# Altium project F1956.PrjPcb
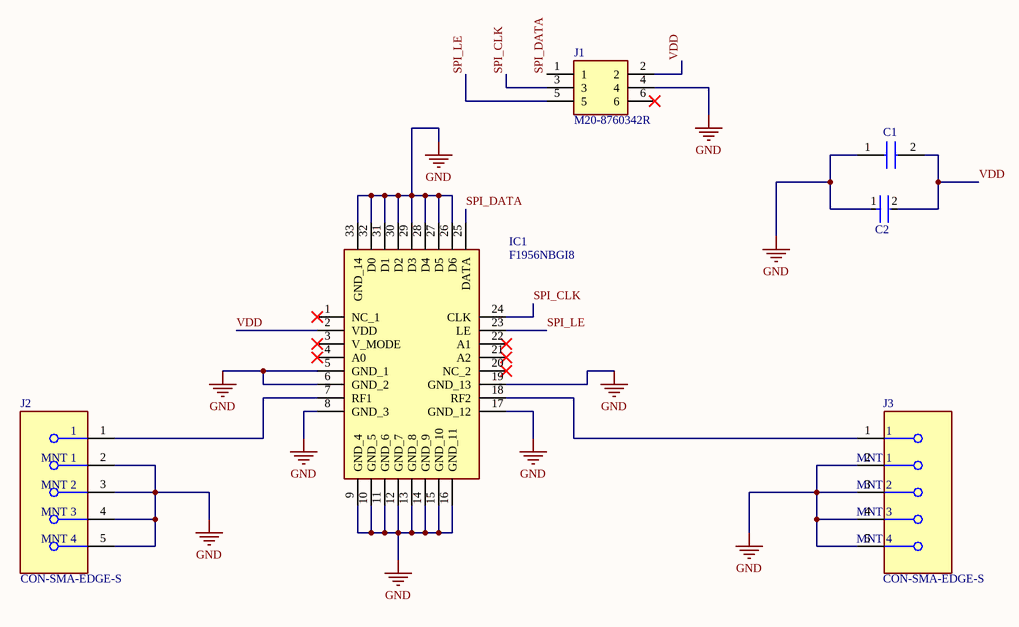
[diagram p0: F1956.SchDoc]
1 sheet, 6 parts. Net scope: global (net labels, ports and power ports of the same name join across sheets).
Board file: F1956.PcbDoc

## Sheet F1956.SchDoc
size A

### Parts
C1  GJ821BR71H105KA12K  [CAPC2012X135N]  (value not drawn)
C2  GRM21A5C2E102FWA1J  [FP-GRM21A-0_2-MFG]  (value not drawn)
IC1  F1956NBGI8  [QFN50P500X500X80-33N-D]
J1  M20-8760342R  [M208760342R]
J2  CON-SMA-EDGE-S  [FP-CON-SMA-EDGE-S-MFG]
J3  CON-SMA-EDGE-S  [FP-CON-SMA-EDGE-S-MFG]

### Nets
GND: C1.1 C2.1 IC1.5(GND_1) IC1.6(GND_2) IC1.8(GND_3) IC1.9(GND_4) IC1.10(GND_5) IC1.11(GND_6) IC1.12(GND_7) IC1.13(GND_8) IC1.14(GND_9) IC1.15(GND_10) IC1.16(GND_11) IC1.17(GND_12) IC1.19(GND_13) IC1.26(D6) IC1.27(D5) IC1.28(D4) IC1.29(D3) IC1.30(D2) IC1.31(D1) IC1.32(D0) IC1.33(GND_14) J1.4 J2.2(MNT_1) J2.3(MNT_2) J2.4(MNT_3) J2.5(MNT_4) J3.2(MNT_1) J3.3(MNT_2) J3.4(MNT_3) J3.5(MNT_4)
SPI_CLK: IC1.24(CLK) J1.3
SPI_DATA: IC1.25(DATA) J1.1
SPI_LE: IC1.23(LE) J1.5
VDD: C1.2 C2.2 IC1.2(VDD) J1.2
NetIC1_7: IC1.7(RF1) J2.1
NetIC1_18: IC1.18(RF2) J3.1

Not connected (* = marked no-connect by the designer): IC1 1(NC_1)* 3(V_MODE)* 4(A0)* 20(NC_2)* 21(A2)* 22(A1)*; J1 6*

### Library data of the parts
C1 = GJ821BR71H105KA12K: Capacitor; Manufacturer_Name: Murata Electronics; Datasheet Link: https://www.mouser.it/datasheet/2/281/GJ821BR71H105KA12-01-1633769.pdf; Height: 1.35mm; Manufacturer_Part_Number: GJ821BR71H105KA12K; Mouser Part Number: 81-GJ821BR71H105KA2K; Mouser Price/Stock: https://www.mouser.co.uk/ProductDetail/Murata-Electronics/GJ821BR71H105KA12K?qs=QzBtWTOodeUPH%252BEtzhwB2g%3D%3D
C2 = CMP-06035-012030-1: Chip Multilayer Ceramic Capacitors for General Purpose, 0805, 1000pF, C0G, 30ppm/°C, 1%, 250V
IC1 = F1956NBGI8: Integrated Circuit; Manufacturer_Name: Renesas Electronics; Datasheet Link: https://www.idt.com/document/dst/f1956-datasheet-rev02; Height: 0.8mm; Manufacturer_Part_Number: F1956NBGI8; Mouser Part Number: 972-F1956NBGI8; Mouser Price/Stock: https://www.mouser.co.uk/ProductDetail/Renesas-Electronics/F1956NBGI8?qs=QilpELpYHq9OafJ8HDkRsg%3D%3D
J1 = M20-8760342R: Connector; Manufacturer_Name: Harwin; Datasheet Link: https://cdn.harwin.com/pdfs/M20-876R.pdf; Height: 11.5mm; Manufacturer_Part_Number: M20-8760342R; Mouser Part Number: 855-M20-8760342R; Mouser Price/Stock: https://www.mouser.co.uk/ProductDetail/Harwin/M20-8760342R?qs=vF78I%252BjhbY%2F5VOL01aBOqA%3D%3D
J2 J3 = CMP-204357-000001-1: CONN SMA JACK STR EDGE MNT; Manufacturer: RF Solutions Ltd.; Impedance: 50Ω; Conn Orientation: Right Angle; Is Female: yes; Number Of Contacts: 1; Frequency: 18GHz; Shielding: true; Category: Conn; ComponentLink2URL: https://www.rfsolutions.co.uk/downloads/1498648656DS-CON-EDGE-SMA-4.pdf; Octopart: https://octopart.com/con-sma-edge-s-rf+solutions-70967450; Package: CONN_JACK; Manufacturer Part Number: CON-SMA-EDGE-S; Height: 6.35mm; Device Class L1: Connectors; Footprint Url: https://forum.upverter.com/uploads/default/original/3X/b/e/be75b907af57498775929d6d9099689c472e0307.pdf; Contact Material: Gold; ComponentLink2Description: Datasheet; Device Class L2: RF / Coaxial Connectors; RoHS: TRUE; Device Class L3: unset; Digikey Description: CONN SMA JACK STR EDGE MNT; Lead Free: Yes; Automotive: No